# EAGLE schematic bc-module-tag (EAGLE 7.7.0)
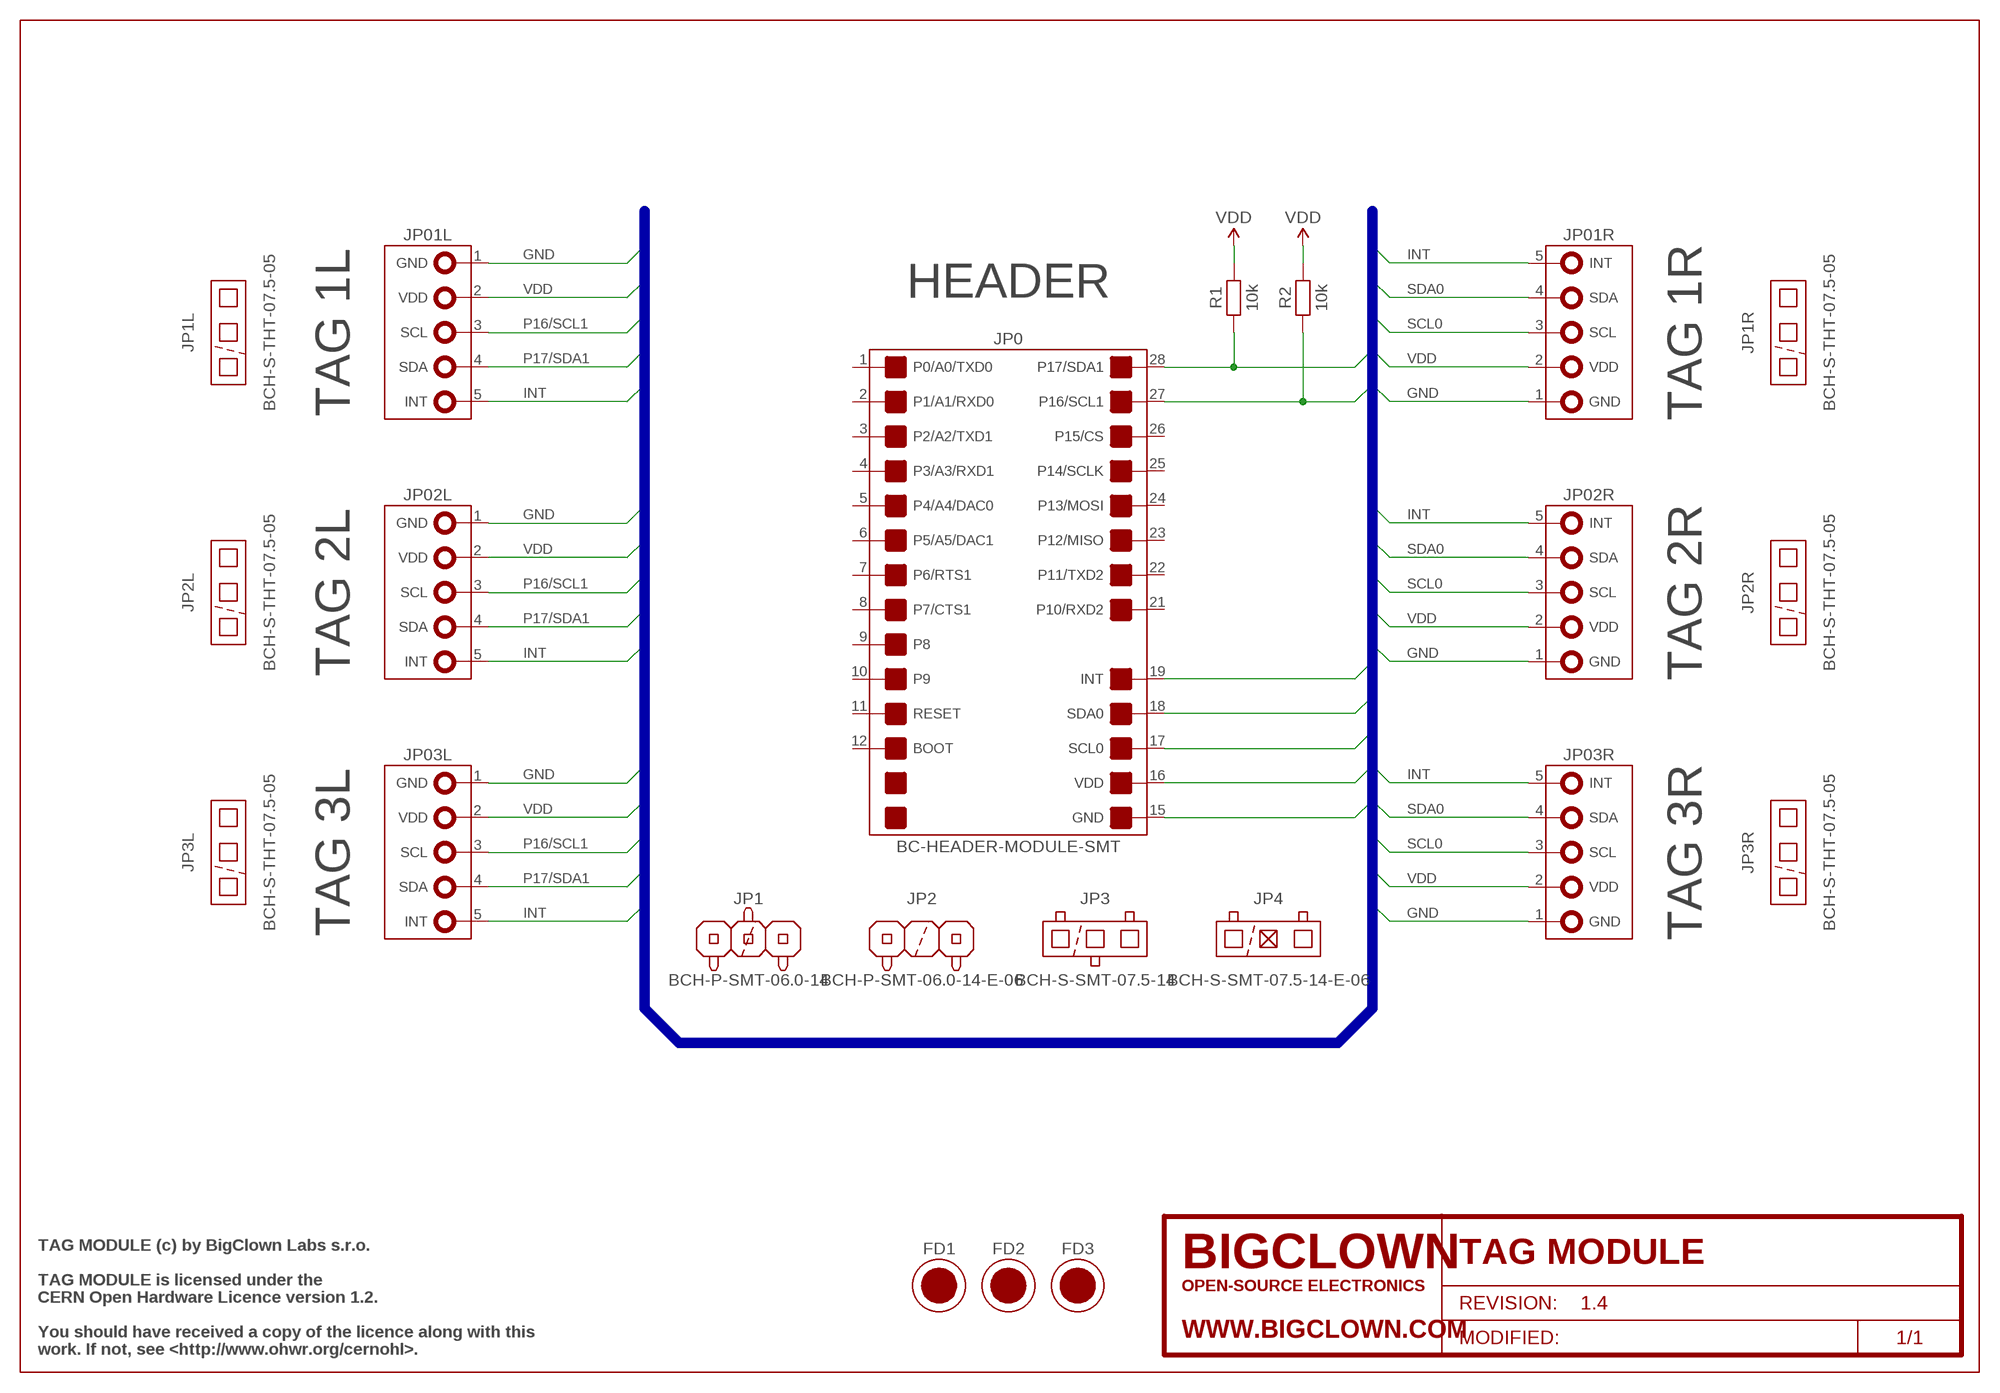
[diagram p0: schematic, sheet 1]

## Parts
FD1  FIDUCIAL  [FIDUCIAL-1MM]
FD2  FIDUCIAL  [FIDUCIAL-1MM]
FD3  FIDUCIAL  [FIDUCIAL-1MM]
FRAME1  FRAME-SCH/A4L-BRD/A4L  [FRAME-A4L]
JP0  BC-HEADER-MODULE-SMT  [BC-HEADER-MODULE-SMT]
JP1  BCH-P-SMT-06.0-14  JP-BCH-P-SMT-06.0-14  [BCH-P-SMT-14]
JP01L  BC-HEADER-TAG-THT  [BC-HEADER-TAG-THT]
JP1L  BCH-S-THT-07.5-05  JP-BCH-S-THT-07.5-05  [BCH-S-THT-05]
JP01R  BC-HEADER-TAG-THT  [BC-HEADER-TAG-THT]
JP1R  BCH-S-THT-07.5-05  JP-BCH-S-THT-07.5-05  [BCH-S-THT-05]
JP2  BCH-P-SMT-06.0-14-E-06  JP-BCH-P-SMT-06.0-14-E-06  [BCH-P-SMT-14-E-06]
JP02L  BC-HEADER-TAG-THT  [BC-HEADER-TAG-THT]
JP2L  BCH-S-THT-07.5-05  JP-BCH-S-THT-07.5-05  [BCH-S-THT-05]
JP02R  BC-HEADER-TAG-THT  [BC-HEADER-TAG-THT]
JP2R  BCH-S-THT-07.5-05  JP-BCH-S-THT-07.5-05  [BCH-S-THT-05]
JP3  BCH-S-SMT-07.5-14  JP-BCH-S-SMT-07.5-14  [BCH-S-SMT-14]
JP03L  BC-HEADER-TAG-THT  [BC-HEADER-TAG-THT]
JP3L  BCH-S-THT-07.5-05  JP-BCH-S-THT-07.5-05  [BCH-S-THT-05]
JP03R  BC-HEADER-TAG-THT  [BC-HEADER-TAG-THT]
JP3R  BCH-S-THT-07.5-05  JP-BCH-S-THT-07.5-05  [BCH-S-THT-05]
JP4  BCH-S-SMT-07.5-14-E-06  JP-BCH-S-SMT-07.5-14-E-06  [BCH-S-SMT-14-E-06]
R1  10k  R-0805-10K  [RESISTOR-0805_R]
R2  10k  R-0805-10K  [RESISTOR-0805_R]

## Nets
GND: JP0.15(GND) JP01L.1(GND) JP01R.1(GND) JP02L.1(GND) JP02R.1(GND) JP03L.1(GND) JP03R.1(GND)
INT: JP0.19(INT) JP01L.5(INT) JP01R.5(INT) JP02L.5(INT) JP02R.5(INT) JP03L.5(INT) JP03R.5(INT)
P16/SCL1: JP0.27(P16/SCL1) JP01L.3(SCL) JP02L.3(SCL) JP03L.3(SCL) R2.1
P17/SDA1: JP0.28(P17/SDA1) JP01L.4(SDA) JP02L.4(SDA) JP03L.4(SDA) R1.1
SCL0: JP0.17(SCL0) JP01R.3(SCL) JP02R.3(SCL) JP03R.3(SCL)
SDA0: JP0.18(SDA0) JP01R.4(SDA) JP02R.4(SDA) JP03R.4(SDA)
VDD: JP0.16(VDD) JP01L.2(VDD) JP01R.2(VDD) JP02L.2(VDD) JP02R.2(VDD) JP03L.2(VDD) JP03R.2(VDD) R1.2 R2.2
Unconnected: JP0.1(P0/A0/TXD0) JP0.2(P1/A1/RXD0) JP0.3(P2/A2/TXD1) JP0.4(P3/A3/RXD1) JP0.5(P4/A4/DAC0) JP0.6(P5/A5/DAC1) JP0.7(P6/RTS1) JP0.8(P7/CTS1) JP0.9(P8) JP0.10(P9) JP0.11(RESET) JP0.12(BOOT) JP0.21(P10/RXD2) JP0.22(P11/TXD2) JP0.23(P12/MISO) JP0.24(P13/MOSI) JP0.25(P14/SCLK) JP0.26(P15/CS)

## Buses
GND,VDD,INT,SDA0,SCL0,P17/SDA1,P16/SCL1

## Notes on the sheet
- HEADER
- TAG 1L | TAG 1R
- TAG 2L | TAG 2R
- TAG 3L | TAG 3R
- TAG MODULE (c) by BigClown Labs s.r.o.
- TAG MODULE is licensed under the
- CERN Open Hardware Licence version 1.2.
- You should have received a copy of the licence along with this
- work. If not, see <http://www.ohwr.org/cernohl>.

## Library data of the parts
FD1-FD3 = bc-fiducial:FIDUCIAL; BCPN: -
FRAME1 = bc-frame:FRAME-SCH/A4L-BRD/A4L; BCPN: -; PROJECT_NAME: TAG MODULE; PROJECT_REVISION: 1.4
JP0 = bc-header:BC-HEADER-MODULE-SMT; BCPN: -
JP1 = bc-header:JP-BCH-P-SMT-06.0-14; BCPN: BC-JP-BCH-P-SMT-06.0-14
JP01L JP01R JP02L JP02R JP03L JP03R = bc-header:BC-HEADER-TAG-THT; BCPN: -
JP1L JP1R JP2L JP2R JP3L JP3R = bc-header:JP-BCH-S-THT-07.5-05; BCPN: BC-JP-BCH-S-THT-07.5-05
JP2 = bc-header:JP-BCH-P-SMT-06.0-14-E-06; BCPN: BC-JP-BCH-P-SMT-06.0-14-E-06
JP3 = bc-header:JP-BCH-S-SMT-07.5-14; BCPN: BC-JP-BCH-S-SMT-07.5-14
JP4 = bc-header:JP-BCH-S-SMT-07.5-14-E-06; BCPN: BC-JP-BCH-S-SMT-07.5-14-E-06
R1 R2 = bc-resistor:R-0805-10K; BCPN: BC-R-0805-10K